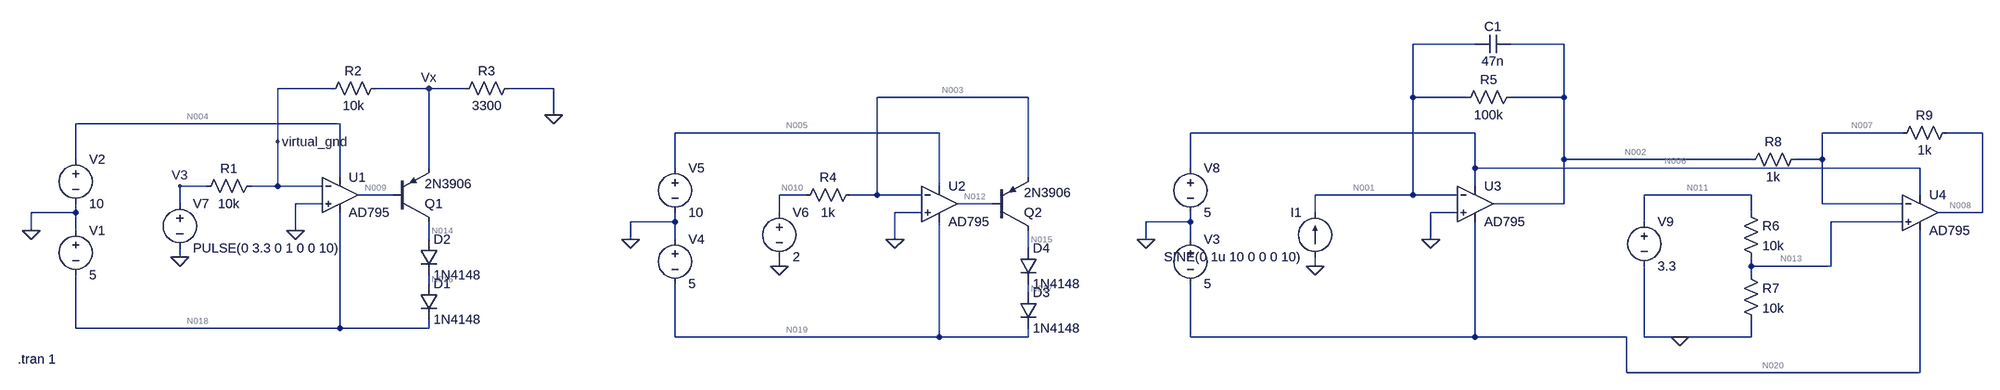
[diagram p0: schematic Draft1.asc]
Draft1.asc, the LTspice schematic file:
Version 4
SHEET 1 3876 680
WIRE 2880 -144 2768 -144
WIRE 3040 -144 2944 -144
WIRE 368 -64 272 -64
WIRE 544 -64 448 -64
WIRE 608 -64 544 -64
WIRE 768 -64 688 -64
WIRE 1920 -48 1648 -48
WIRE 2768 -48 2768 -144
WIRE 2864 -48 2768 -48
WIRE 3040 -48 3040 -144
WIRE 3040 -48 2944 -48
WIRE 768 -16 768 -64
WIRE 384 0 -128 0
WIRE 1760 16 1248 16
WIRE 2880 16 2368 16
WIRE 3728 16 3584 16
WIRE 3872 16 3808 16
WIRE 272 32 272 -64
WIRE -128 64 -128 0
WIRE 3040 64 3040 -48
WIRE 3456 64 3040 64
WIRE 3584 64 3584 16
WIRE 3584 64 3536 64
WIRE 544 80 544 -64
WIRE 1248 80 1248 16
WIRE 2368 80 2368 16
WIRE 2880 80 2880 16
WIRE 3760 80 2880 80
WIRE 384 96 384 0
WIRE 1920 96 1920 -48
WIRE 144 112 96 112
WIRE 272 112 272 32
WIRE 272 112 224 112
WIRE 352 112 272 112
WIRE 1760 112 1760 16
WIRE 2880 112 2880 80
WIRE 480 128 416 128
WIRE 1520 128 1472 128
WIRE 1648 128 1648 -48
WIRE 1648 128 1600 128
WIRE 1728 128 1648 128
WIRE 2768 128 2768 -48
WIRE 2768 128 2592 128
WIRE 2848 128 2768 128
WIRE 3456 128 3264 128
WIRE 3760 128 3760 80
WIRE 96 144 96 112
WIRE 352 144 304 144
WIRE 1856 144 1792 144
WIRE 3040 144 3040 64
WIRE 3040 144 2912 144
WIRE 3584 144 3584 64
WIRE 3728 144 3584 144
WIRE -128 160 -128 144
WIRE -128 160 -208 160
WIRE 1472 160 1472 128
WIRE 1728 160 1680 160
WIRE 2592 160 2592 128
WIRE 2848 160 2800 160
WIRE 3456 160 3456 128
WIRE 3872 160 3872 16
WIRE 3872 160 3792 160
WIRE 1248 176 1248 160
WIRE 1248 176 1168 176
WIRE 2368 176 2368 160
WIRE 2368 176 2288 176
WIRE 3264 176 3264 128
WIRE 3728 176 3600 176
WIRE -208 192 -208 160
WIRE -128 192 -128 160
WIRE 304 192 304 144
WIRE 544 208 544 176
WIRE 1168 208 1168 176
WIRE 1248 208 1248 176
WIRE 1680 208 1680 160
WIRE 2288 208 2288 176
WIRE 2368 208 2368 176
WIRE 2800 208 2800 160
WIRE 1920 224 1920 192
WIRE 96 240 96 224
WIRE 1472 256 1472 240
WIRE 2592 256 2592 240
WIRE 3456 256 3456 240
WIRE 3600 256 3600 176
WIRE 3600 256 3456 256
WIRE 3456 272 3456 256
WIRE 544 288 544 272
WIRE 1920 304 1920 288
WIRE -128 368 -128 272
WIRE 384 368 384 160
WIRE 384 368 -128 368
WIRE 544 368 544 352
WIRE 544 368 384 368
WIRE 1248 384 1248 288
WIRE 1760 384 1760 176
WIRE 1760 384 1248 384
WIRE 1920 384 1920 368
WIRE 1920 384 1760 384
WIRE 2368 384 2368 288
WIRE 2880 384 2880 176
WIRE 2880 384 2368 384
WIRE 3232 384 2880 384
WIRE 3264 384 3264 256
WIRE 3328 384 3264 384
WIRE 3456 384 3456 352
WIRE 3456 384 3328 384
WIRE 3232 448 3232 384
WIRE 3760 448 3760 192
WIRE 3760 448 3232 448
FLAG -208 192 0
FLAG 96 240 0
FLAG 768 -16 0
FLAG 304 192 0
FLAG 96 112 V3
FLAG 544 -64 Vx
FLAG 272 32 virtual_gnd
FLAG 1168 208 0
FLAG 1472 256 0
FLAG 1680 208 0
FLAG 2288 208 0
FLAG 2592 256 0
FLAG 2800 208 0
FLAG 3328 384 0
SYMBOL voltage -128 176 R0
WINDOW 123 0 0 Left 0
WINDOW 39 0 0 Left 0
SYMATTR InstName V1
SYMATTR Value 5
SYMBOL voltage -128 48 R0
WINDOW 123 0 0 Left 0
WINDOW 39 0 0 Left 0
SYMATTR InstName V2
SYMATTR Value 10
SYMBOL res 240 96 R90
WINDOW 0 0 56 VBottom 2
WINDOW 3 32 56 VTop 2
SYMATTR InstName R1
SYMATTR Value 10k
SYMBOL res 464 -80 R90
WINDOW 0 0 56 VBottom 2
WINDOW 3 32 56 VTop 2
SYMATTR InstName R2
SYMATTR Value 10k
SYMBOL res 704 -80 R90
WINDOW 0 0 56 VBottom 2
WINDOW 3 32 56 VTop 2
SYMATTR InstName R3
SYMATTR Value 3300
SYMBOL diode 528 288 R0
SYMATTR InstName D1
SYMATTR Value 1N4148
SYMBOL diode 528 208 R0
SYMATTR InstName D2
SYMATTR Value 1N4148
SYMBOL OpAmps\\AD795 384 64 R0
SYMATTR InstName U1
SYMBOL voltage 1248 192 R0
WINDOW 123 0 0 Left 0
WINDOW 39 0 0 Left 0
SYMATTR InstName V4
SYMATTR Value 5
SYMBOL voltage 1248 64 R0
WINDOW 123 0 0 Left 0
WINDOW 39 0 0 Left 0
SYMATTR InstName V5
SYMATTR Value 10
SYMBOL voltage 1472 144 R0
WINDOW 123 0 0 Left 0
WINDOW 39 0 0 Left 0
SYMATTR InstName V6
SYMATTR Value 2
SYMBOL res 1616 112 R90
WINDOW 0 0 56 VBottom 2
WINDOW 3 32 56 VTop 2
SYMATTR InstName R4
SYMATTR Value 1k
SYMBOL diode 1904 304 R0
SYMATTR InstName D3
SYMATTR Value 1N4148
SYMBOL diode 1904 224 R0
SYMATTR InstName D4
SYMATTR Value 1N4148
SYMBOL pnp 1856 192 M180
SYMATTR InstName Q2
SYMATTR Value 2N3906
SYMBOL OpAmps\\AD795 1760 80 R0
SYMATTR InstName U2
SYMBOL pnp 480 176 M180
SYMATTR InstName Q1
SYMATTR Value 2N3906
SYMBOL voltage 96 128 R0
WINDOW 123 0 0 Left 0
WINDOW 39 0 0 Left 0
SYMATTR InstName V7
SYMATTR Value PULSE(0 3.3 0 1 0 0 10)
SYMBOL voltage 2368 192 R0
WINDOW 123 0 0 Left 0
WINDOW 39 0 0 Left 0
SYMATTR InstName V3
SYMATTR Value 5
SYMBOL voltage 2368 64 R0
WINDOW 123 0 0 Left 0
WINDOW 39 0 0 Left 0
SYMATTR InstName V8
SYMATTR Value 5
SYMBOL OpAmps\\AD795 2880 80 R0
SYMATTR InstName U3
SYMBOL current 2592 240 R180
WINDOW 0 24 80 Left 2
WINDOW 3 24 0 Left 2
WINDOW 123 0 0 Left 0
WINDOW 39 0 0 Left 0
SYMATTR InstName I1
SYMATTR Value SINE(0 1u 10 0 0 0 10)
SYMBOL res 2960 -64 R90
WINDOW 0 0 56 VBottom 2
WINDOW 3 32 56 VTop 2
SYMATTR InstName R5
SYMATTR Value 100k
SYMBOL cap 2944 -160 R90
WINDOW 0 0 32 VBottom 2
WINDOW 3 32 32 VTop 2
SYMATTR InstName C1
SYMATTR Value 47n
SYMBOL OpAmps\\AD795 3760 96 R0
SYMATTR InstName U4
SYMBOL voltage 3264 160 R0
WINDOW 123 0 0 Left 0
WINDOW 39 0 0 Left 0
SYMATTR InstName V9
SYMATTR Value 3.3
SYMBOL res 3440 144 R0
SYMATTR InstName R6
SYMATTR Value 10k
SYMBOL res 3440 256 R0
SYMATTR InstName R7
SYMATTR Value 10k
SYMBOL res 3552 48 R90
WINDOW 0 0 56 VBottom 2
WINDOW 3 32 56 VTop 2
SYMATTR InstName R8
SYMATTR Value 1k
SYMBOL res 3824 0 R90
WINDOW 0 0 56 VBottom 2
WINDOW 3 32 56 VTop 2
SYMATTR InstName R9
SYMATTR Value 1k
TEXT -232 424 Left 2 !.tran 1

The netlist it stands for:
* Draft1.asc
V1 0 N018 5
V2 N004 0 10
R1 virtual_gnd V3 10k
R2 Vx virtual_gnd 10k
R3 0 Vx 3300
D1 N016 N018 1N4148
D2 N014 N016 1N4148
XU1 0 virtual_gnd N004 N018 N009 AD795  ; pins In+ In- V+ V- OUT
V4 0 N019 5
V5 N005 0 10
V6 N010 0 2
R4 N003 N010 1k
D3 N017 N019 1N4148
D4 N015 N017 1N4148
Q2 N015 N012 N003 0 2N3906
XU2 0 N003 N005 N019 N012 AD795  ; pins In+ In- V+ V- OUT
Q1 N014 N009 Vx 0 2N3906
V7 V3 0 PULSE(0 3.3 0 1 0 0 10)
V3 0 N020 5
V8 N006 0 5
XU3 0 N001 N006 N020 N002 AD795  ; pins In+ In- V+ V- OUT
I1 0 N001 SINE(0 1u 10 0 0 0 10)
R5 N002 N001 100k
C1 N002 N001 47n
XU4 N013 N007 N006 N020 N008 AD795  ; pins In+ In- V+ V- OUT
V9 N011 0 3.3
R6 N011 N013 10k
R7 N013 0 10k
R8 N007 N002 1k
R9 N008 N007 1k
.model D D
.lib standard.dio
.model NPN NPN
.model PNP PNP
.lib standard.bjt
.tran 1
.lib ADI1.lib
.backanno
.end

* Results of the author's LTspice run, read from the files saved beside the schematic
* Operating Point, zero values left out:
*   V(n018) = -5 V
*   V(n004) = 10 V
*   V(n016) = -5 V
*   V(n014) = -5 V
*   V(n009) = 3.432 V
*   V(n019) = -5 V
*   V(n005) = 10 V
*   V(n010) = 2 V
*   V(n003) = 3.657 µV
*   V(n017) = -4.384 V
*   V(n015) = -3.767 V
*   V(n012) = -672.6 mV
*   V(n020) = -5 V
*   V(n006) = 5 V
*   V(n001) = 378.7 nV
*   V(n002) = 378.7 nV
*   V(n007) = 1.069 V
*   V(n013) = 1.65 V
*   V(n008) = 2.139 V
*   V(n011) = 3.3 V
*   Ic(Q1) = -8.438 pA
*   Ib(Q1) = 11.87 pA
*   Ie(Q1) = -3.432 pA
*   Ic(Q2) = -1.99 mA
*   Ib(Q2) = -9.699 µA
*   Ie(Q2) = 2 mA
*   I(D4) = 1.99 mA
*   I(D3) = 1.99 mA
*   I(D2) = 8.441 pA
*   I(D1) = 8.444 pA
*   I(R9) = 1.069 mA
*   I(R8) = 1.069 mA
*   I(R7) = 165 µA
*   I(R6) = 165 µA
*   I(R4) = -2 mA
*   I(R3) = -2.951 pA
*   I(V9) = -165 µA
*   I(V8) = -3.089 mA
*   I(V3) = -3.097 mA
*   I(V6) = -2 mA
*   I(V5) = -1.221 mA
*   I(V4) = -3.221 mA
*   I(V2) = -1.226 mA
*   I(V1) = -1.226 mA
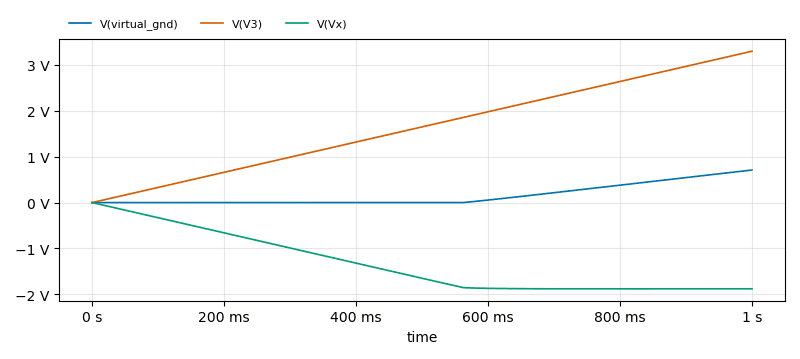
[diagram p1: Transient Analysis of Draft1.asc, plotted from the saved traces]
* Transient Analysis, 1 run:
*   V(virtual_gnd): min 0 V, max 710.1 mV, average 153.1 mV, rms 268.9 mV, last 710.1 mV
*   V(V3): min 0 V, max 3.3 V, average 1.65 V, rms 1.905 V, last 3.3 V
*   V(Vx): min -1.881 V, max 88.79 µV, average -1.344 V, rms 1.48 V, last -1.88 V